# Altium schematic sheet main.SchDoc
size A4
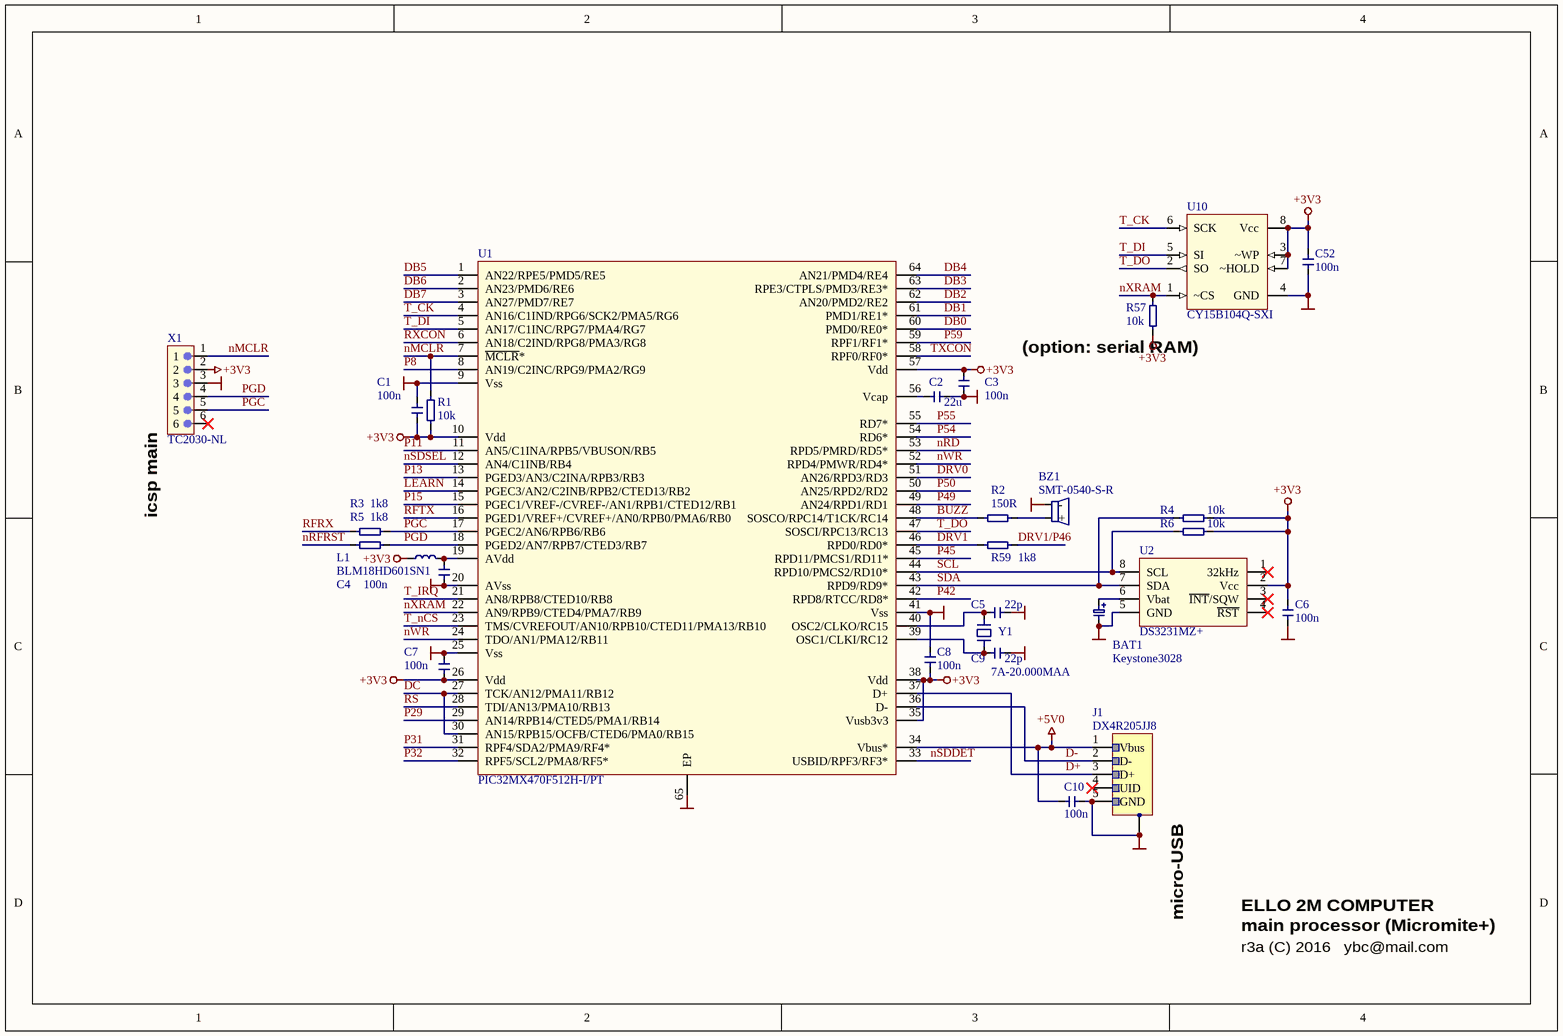
[diagram p0: main.SchDoc]

## Parts
BAT1  Keystone3028  [KEYSTONE3028/34]
BZ1  SMT-0540-S-R  [SMT-0540-S-R]
C1  100n  [_0603]
C2  22u  [_1206]
C3  100n  [_0603]
C4  100n  [_0603]
C5  22p  [_0603]
C6  100n  [_0603]
C7  100n  [_0603]
C8  100n  [_0603]
C9  22p  [_0603]
C10  100n  [_0603]
C52  100n  [_0603]
J1  DX4R205JJ8  [DX4R205JJ8]
L1  BLM18HD601SN1  [_0603]
R1  10k  [_0603]
R2  150R  [_0603]
R3  1k8  [_0603]
R4  10k  [_0603]
R5  1k8  [_0603]
R6  10k  [_0603]
R57  10k  [_0603]
R59  1k8  [_0603]
U1  PIC32MX470F512H-I/PT  [QFP50P1200X1200X120-65N-S600]
U2  DS3231MZ+  [SOIC8]
U10  CY15B104Q-SXI  [SOIC127P790X216-8N]
X1  TC2030-NL  [TC2030-NL]  (no BOM)
Y1  7A-20.000MAA  [Crystal 50x32 (2)]

## Nets
+3V3: C1.2 C3.1 C6.1 C7.2 C8.2 C52.2 L1.1 R1.1 R4.2 R6.2 R57.1 U1.10(Vdd) U1.26(Vdd) U1.35(Vusb3v3) U1.38(Vdd) U1.57(Vdd) U2.2(Vcc) U10.3(~WP) U10.7(~HOLD) U10.8(Vcc) X1.2
+5V0: C10.2 J1.1(Vbus) U1.34(Vbus*)
GND: BAT1.- BZ1.2(-) C1.1 C2.1 C3.2 C4.2 C5.2 C6.2 C7.1 C8.1 C9.2 C10.1 C52.1 J1.5(GND) U1.9(Vss) U1.20(AVss) U1.25(Vss) U1.41(Vss) U1.65(EP) U2.5(GND) U10.4(GND) X1.3
BUZZ: R2.1 U1.48(SOSCO/RPC14/T1CK/RC14)
D+: J1.3(D+) U1.37(D+)
D-: J1.2(D-) U1.36(D-)
DB0: U1.60(PMD0/RE0*)
DB1: U1.61(PMD1/RE1*)
DB2: U1.62(AN20/PMD2/RE2)
DB3: U1.63(RPE3/CTPLS/PMD3/RE3*)
DB4: U1.64(AN21/PMD4/RE4)
DB5: U1.1(AN22/RPE5/PMD5/RE5)
DB6: U1.2(AN23/PMD6/RE6)
DB7: U1.3(AN27/PMD7/RE7)
DC: U1.27(TCK/AN12/PMA11/RB12) U1.30(AN15/RPB15/OCFB/CTED6/PMA0/RB15)
DRV0: U1.51(AN26/RPD3/RD3)
DRV1: R59.2 U1.46(RPD0/RD0*)
DRV1/P46: R59.1
LEARN: U1.14(PGEC3/AN2/C2INB/RPB2/CTED13/RB2)
nMCLR: R1.2 U1.7(~{MCLR}*) X1.1
nRD: U1.53(RPD5/PMRD/RD5*)
nRFRST: R5.1
nSDDET: U1.33(USBID/RPF3/RF3*)
nSDSEL: U1.12(AN4/C1INB/RB4)
nWR: U1.24(TDO/AN1/PMA12/RB11) U1.52(RPD4/PMWR/RD4*)
nXRAM: R57.2 U1.22(AN9/RPB9/CTED4/PMA7/RB9) U10.1(~CS)
P8: U1.8(AN19/C2INC/RPG9/PMA2/RG9)
P11: U1.11(AN5/C1INA/RPB5/VBUSON/RB5)
P13: U1.13(PGED3/AN3/C2INA/RPB3/RB3)
P15: U1.15(PGEC1/VREF-/CVREF-/AN1/RPB1/CTED12/RB1)
P29: U1.29(AN14/RPB14/CTED5/PMA1/RB14)
P31: U1.31(RPF4/SDA2/PMA9/RF4*)
P32: U1.32(RPF5/SCL2/PMA8/RF5*)
P42: U1.42(RPD8/RTCC/RD8*)
P45: U1.45(RPD11/PMCS1/RD11*)
P49: U1.49(AN24/RPD1/RD1)
P50: U1.50(AN25/RPD2/RD2)
P54: U1.54(RD6*)
P55: U1.55(RD7*)
P59: U1.59(RPF1/RF1*)
PGC: R3.2 U1.17(PGEC2/AN6/RPB6/RB6) X1.5
PGD: R5.2 U1.18(PGED2/AN7/RPB7/CTED3/RB7) X1.4
RFRX: R3.1
RFTX: U1.16(PGED1/VREF+/CVREF+/AN0/RPB0/PMA6/RB0)
RS: U1.28(TDI/AN13/PMA10/RB13)
RXCON: U1.6(AN18/C2IND/RPG8/PMA3/RG8)
SCL: R6.1 U1.44(RPD10/PMCS2/RD10*) U2.8(SCL)
SDA: R4.1 U1.43(RPD9/RD9*) U2.7(SDA)
T_CK: U1.4(AN16/C1IND/RPG6/SCK2/PMA5/RG6) U10.6(SCK)
T_DI: U1.5(AN17/C1INC/RPG7/PMA4/RG7) U10.5(SI)
T_DO: U1.47(SOSCI/RPC13/RC13) U10.2(SO)
T_IRQ: U1.21(AN8/RPB8/CTED10/RB8)
T_nCS: U1.23(TMS/CVREFOUT/AN10/RPB10/CTED11/PMA13/RB10)
TXCON: U1.58(RPF0/RF0*)
NetBAT1_+: BAT1.+ U2.6(Vbat)
NetBZ1_1: BZ1.1(+) R2.2
NetC2_2: C2.2 U1.56(Vcap)
NetC4_1: C4.1 L1.2 U1.19(AVdd)
NetC5_1: C5.1 U1.40(OSC2/CLKO/RC15) Y1.2
NetC9_1: C9.1 U1.39(OSC1/CLKI/RC12) Y1.1

Not connected (* = marked no-connect by the designer): J1 4(UID)*; U2 1(32kHz)* 3(~{INT}/SQW)* 4(~{RST})*; X1 6*

## Notes on the sheet
- (option: serial RAM)
- (near X1) icsp main
- (near J1) micro-USB
- ELLO 2M COMPUTER
- r3a (C) 2016   ybc@mail.com
- main processor (Micromite+)

## Library data of the parts
BAT1 = Capacitor+: Polar capacitor
BZ1 = Speaker: Speaker/Buzzer
C1-C10 C52 = Capacitor
J1 = Mini/Micro USB: MicroUSB type A/B, 5 Position SMT Right Angle Receptacle
L1 = Inductor
R1-R6 R57 R59 = Resistor
U1 = PIC32MX4xx: 32-bit Microcontrollers (up to 512 KB Flash and 128 KB SRAM)  with Audio/Graphics/Touch (HMI), USB, and Advanced Analog; Manufacturer: Microchip; Similar Series: MX330/350/370/430/450/470
U2 = DS3231: I2C Real-Time Clock; Manufacturer: Maxim Integrated; Note: DS3232 is pin-compatible with DS3231
U10 = SPI Flash 8pin: Standard 8-pin SPI flash memory
X1 = TC2030: TC2030 nails connector; Manufacturer: www.tag-connect.com
Y1 = Crystal: Crystal Resonator